# EAGLE design txb0104 (EAGLE 6.1)
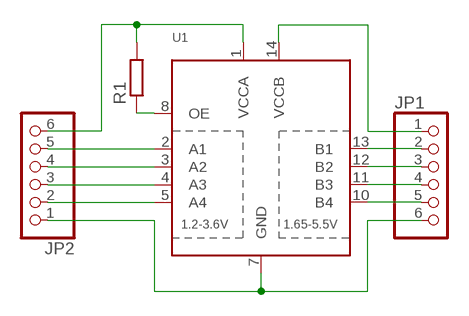
[diagram p0: schematic, sheet 1]

## Parts
JP1  PINHD-1X6  [1X06]
JP2  PINHD-1X6  [1X06]
R1  R-EU_M0805  [M0805]
U1  TXB0104PWRSOIC14  [SO14]

## Nets
GND: JP1.6 JP2.1 U1.7(GND)
N$1: JP1.2 U1.13(B1)
N$2: JP1.3 U1.12(B2)
N$3: JP1.4 U1.11(B3)
N$4: JP1.5 U1.10(B4)
N$5: JP2.2 U1.5(A4)
N$6: JP2.3 U1.4(A3)
N$7: JP2.4 U1.3(A2)
N$8: JP2.5 U1.2(A1)
N$10: JP1.1 U1.14(VCCB)
N$11: JP2.6 R1.2 U1.1(VCCA)
N$12: R1.1 U1.8(OE)

## Library data of the parts
JP1 JP2 = pinhead:PINHD-1X6: PIN HEADER
R1 = rcl:R-EU_: RESISTOR, European symbol
U1 = SparkFun-DigitalIC:TXB0104PWR: 4-Bit Bi-Directional Level Shifter 1.2V-3.6V (VCCA) to 1.65V-5.5V (VCCB) bi-directional level shifter with auto direction sensing. Max data rate - VCCA 1.8V: 20Mbps (50ns), VCCA 3.3V: 100Mbps (10ns) Digikey: 296-21929-1-ND (TSSOP) IC-11329; PROD_ID: IC-11329

## Board
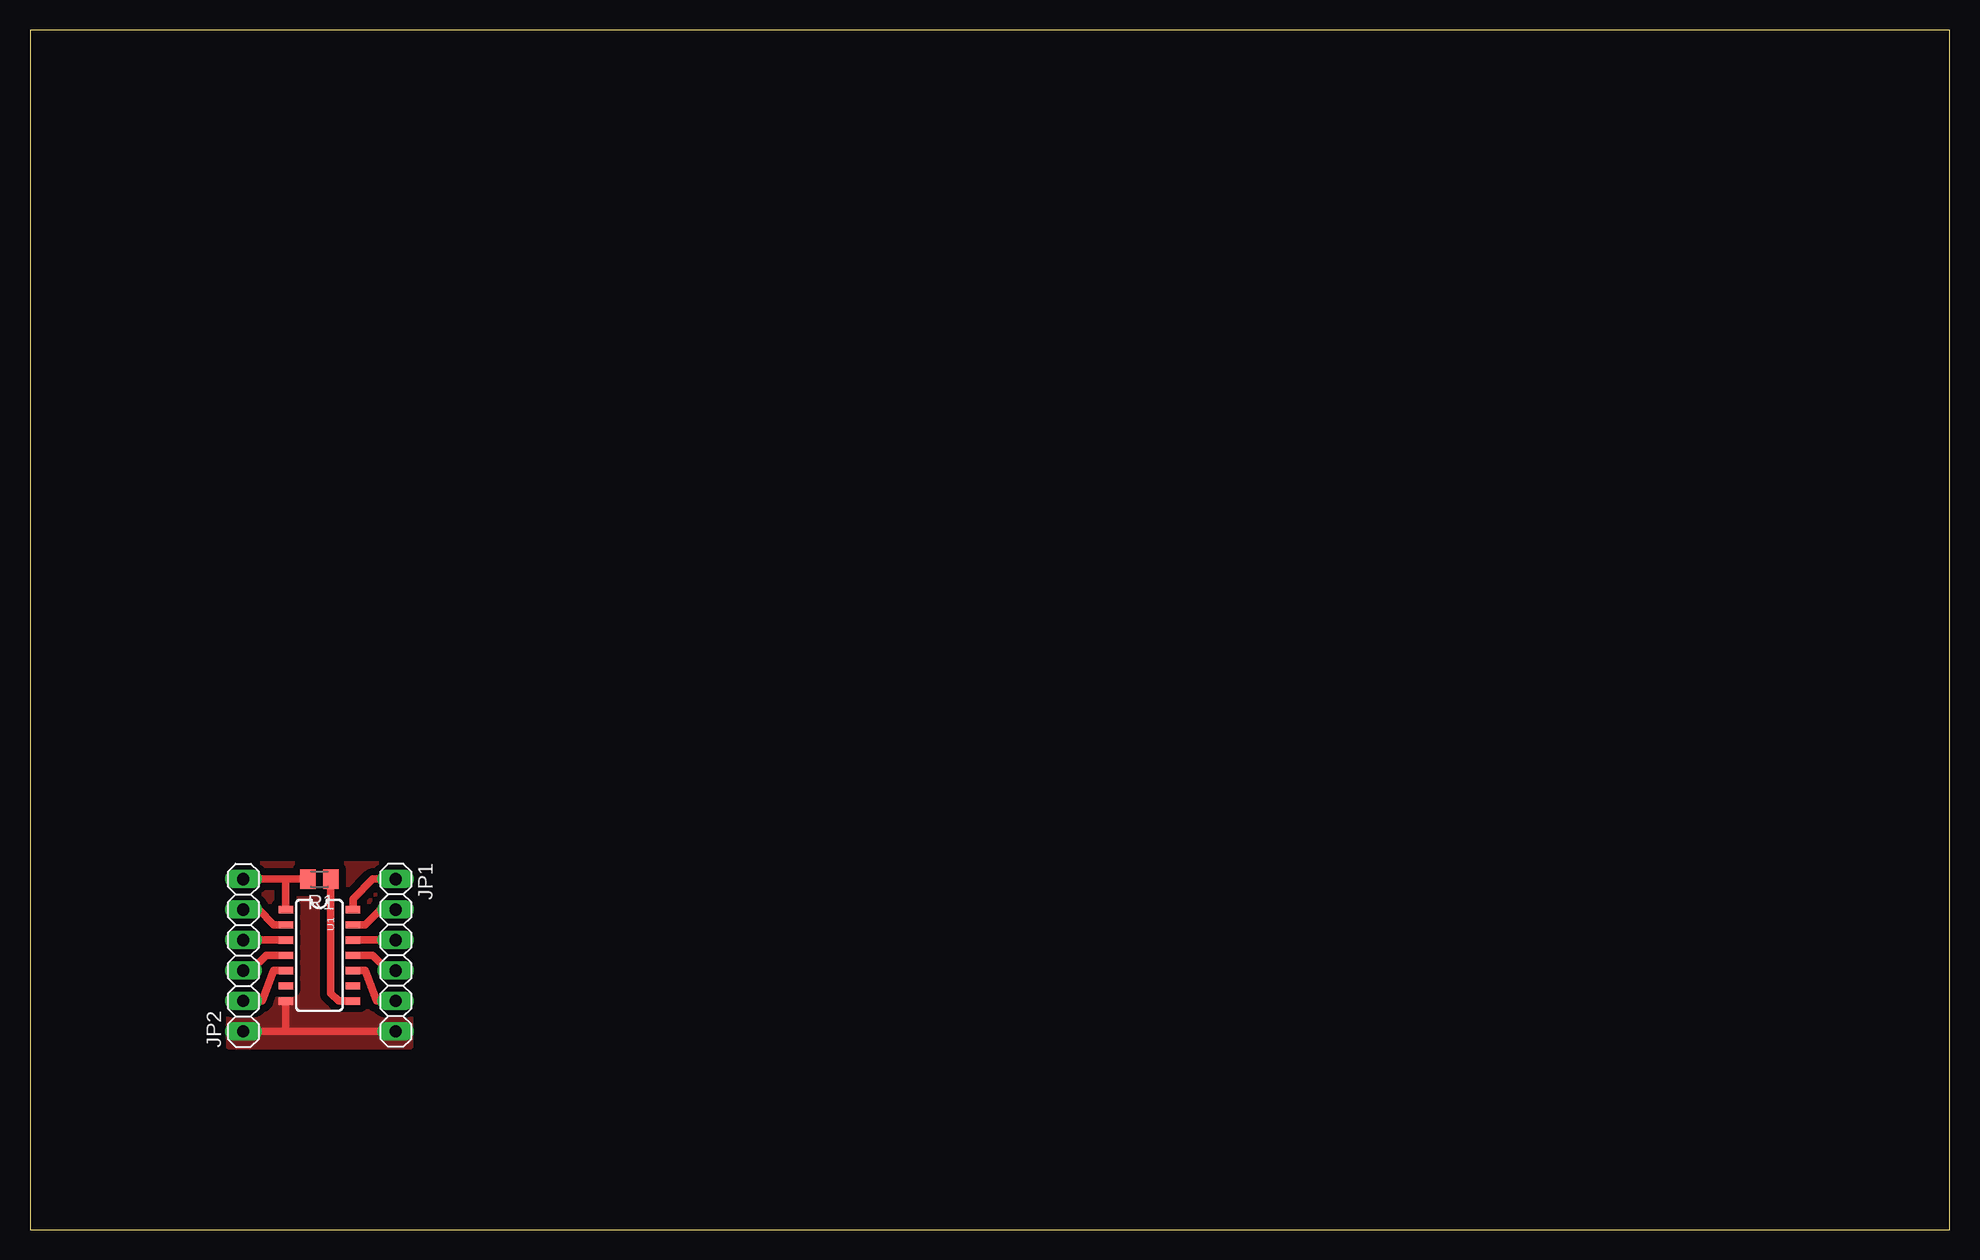
[diagram p1: board, top side]

Size 160 x 100 mm. Coordinates in mm from the lower left corner, seen from the top.
Outline: 0,0 160,0 160,100 0,100 0,0
Copper layers (1*16): Top 0.035mm / dielectric 1.5mm / Bottom 0.035mm
Design rules: minimum track width 10mil, minimum drill 24mil, track to track 12mil, track to pad 12mil, pad to pad 12mil, via to via 12mil, smd to smd 10mil, copper to edge 12mil, drill to drill 12mil, minimum pad ring 10mil, minimum via ring 10mil, stop-mask expansion 4mil, vias tented up to drill 0mil, thermal gap 12mil

### Footprints (pad centres in the part's own frame; a part is rotated, then mirrored left to right if it is on the bottom)
1X06 = drill 1.016 long: 1 -6.35,0; 2 -3.81,0; 3 -1.27,0; 4 1.27,0; 5 3.81,0; 6 6.35,0
M0805 = smd 1.3 x 1.6: 1 -0.95,0; 2 0.95,0
SO14 = smd 0.6 x 1.2: 1 -3.81,-2.8; 2 -2.54,-2.8; 3 -1.27,-2.8; 4 0,-2.8; 5 1.27,-2.8; 6 2.54,-2.8; 7 3.81,-2.8; 8 3.81,2.8; 9 2.54,2.8; 10 1.27,2.8; 11 0,2.8; 12 -1.27,2.8; 13 -2.54,2.8; 14 -3.81,2.8

### Placement (x,y rotation side)
JP1  30.48,22.86 270 top
JP2  17.78,22.86 90 top
R1  24.13,29.21 180 top
U1  24.13,22.86 270 top

### Tracks (layer width: path | path; a pad name or v marks a point on that pad's centre or on a via)
GND
  Top 0.61: U1.7 21.33,16.57 21.27,16.51 | 21.27,16.51 JP2.1 | JP1.6 21.27,16.51
  pour Top (isolate 0.61, no thermals): 16.51,15.24 31.75,15.24 31.75,30.48 16.51,30.48
N$1
  Top 0.61: U1.13 27.94,25.4 29.21,26.67 JP1.2
N$2
  Top 0.61: U1.12 JP1.3
N$3
  Top 0.61: U1.11 28.57,22.86 29.84,21.59 JP1.4
N$4
  Top 0.61: U1.10 27.94,21.59 28.89,19.05 JP1.5
N$5
  Top 0.61: JP2.2 19.37,19.05 20.32,21.59 U1.5
N$6
  Top 0.61: U1.4 19.68,22.86 18.41,21.59 JP2.3
N$7
  Top 0.61: U1.3 JP2.4
N$8
  Top 0.61: U1.2 20.32,25.4 19.05,26.67 JP2.5
N$10
  Top 0.61: U1.14 26.93,27.57 28.57,29.21 JP1.1
N$11
  Top 0.61: JP2.6 21.27,29.21 | 21.27,29.21 R1.2 | U1.1 21.33,29.15 21.27,29.21
N$12
  Top 0.61: R1.1 25.08,19.69 25.72,19.05 U1.8